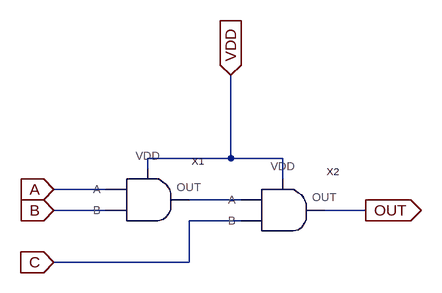
[diagram p0: schematic and3.asc]
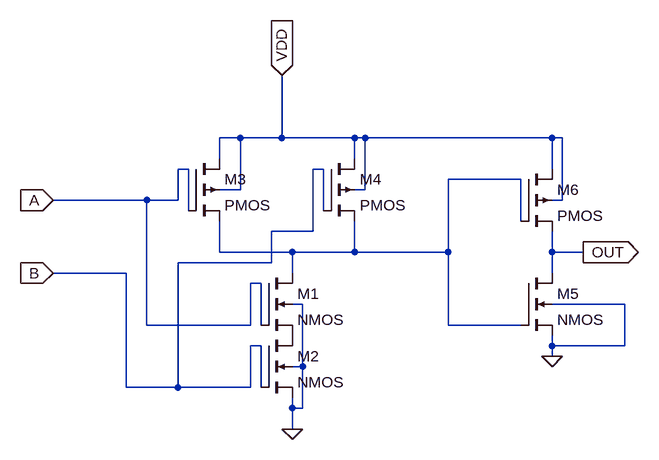
[diagram p1: sub-circuit and.asc]
and3.asc, the LTspice schematic file:
Version 4
SHEET 1 880 680
WIRE 208 16 208 -112
WIRE 208 16 80 16
WIRE 288 16 208 16
WIRE 80 32 80 16
WIRE 288 48 288 16
WIRE 16 64 -64 64
WIRE 224 80 144 80
WIRE 16 96 -64 96
WIRE 416 96 352 96
WIRE 224 112 144 112
WIRE 144 176 144 112
WIRE 144 176 -64 176
FLAG -64 64 A
IOPIN -64 64 In
FLAG -64 96 B
IOPIN -64 96 In
FLAG -64 176 C
IOPIN -64 176 In
FLAG 416 96 OUT
IOPIN 416 96 Out
FLAG 208 -112 VDD
IOPIN 208 -112 In
SYMBOL and 64 80 R0
SYMATTR InstName X1
SYMBOL and 272 96 R0
SYMATTR InstName X2

and.asc, the sub-circuit schematic file:
Version 4
SHEET 1 1116 788
WIRE 112 -32 80 -32
WIRE 176 -32 176 -128
WIRE 176 -32 112 -32
WIRE 288 -32 176 -32
WIRE 304 -32 288 -32
WIRE 592 -32 304 -32
WIRE 608 -32 592 -32
WIRE 80 0 80 -32
WIRE 288 0 288 -32
WIRE 32 16 16 16
WIRE 240 16 224 16
WIRE 592 16 592 -32
WIRE 544 32 432 32
WIRE 112 48 112 -32
WIRE 112 48 80 48
WIRE 304 48 304 -32
WIRE 304 48 288 48
WIRE -32 64 -176 64
WIRE 16 64 16 16
WIRE 16 64 -32 64
WIRE 608 64 608 -32
WIRE 608 64 592 64
WIRE 32 80 32 16
WIRE 240 80 240 16
WIRE 544 96 544 32
WIRE 224 112 224 16
WIRE 224 112 160 112
WIRE 80 144 80 96
WIRE 192 144 80 144
WIRE 288 144 288 96
WIRE 288 144 192 144
WIRE 432 144 432 32
WIRE 432 144 288 144
WIRE 592 144 592 112
WIRE 640 144 592 144
WIRE 160 160 160 112
WIRE 160 160 16 160
WIRE -64 176 -176 176
WIRE 192 176 192 144
WIRE 592 176 592 144
WIRE 144 192 128 192
WIRE 208 224 192 224
WIRE 704 224 592 224
WIRE -32 256 -32 64
WIRE 128 256 128 192
WIRE 128 256 -32 256
WIRE 144 256 144 192
WIRE 432 256 432 144
WIRE 544 256 432 256
WIRE 144 288 128 288
WIRE 592 288 592 272
WIRE 704 288 704 224
WIRE 704 288 592 288
WIRE 592 304 592 288
WIRE 208 320 208 224
WIRE 208 320 192 320
WIRE -64 352 -64 176
WIRE 16 352 16 160
WIRE 16 352 -64 352
WIRE 128 352 128 288
WIRE 128 352 16 352
WIRE 144 352 144 288
WIRE 192 384 192 368
WIRE 208 384 208 320
WIRE 208 384 192 384
WIRE 192 416 192 384
FLAG 192 416 0
FLAG -176 64 A
IOPIN -176 64 In
FLAG -176 176 B
IOPIN -176 176 In
FLAG 176 -128 VDD
IOPIN 176 -128 In
FLAG 592 304 0
FLAG 640 144 OUT
IOPIN 640 144 Out
SYMBOL nmos4 144 176 R0
SYMATTR InstName M1
SYMATTR Value2 l=90n w=200n
SYMBOL nmos4 144 272 R0
SYMATTR InstName M2
SYMATTR Value2 l=90n w=200n
SYMBOL pmos4 32 0 R0
SYMATTR InstName M3
SYMATTR Value2 l=90n w=400n
SYMBOL pmos4 240 0 R0
SYMATTR InstName M4
SYMATTR Value2 l=90n w=400n
SYMBOL nmos4 544 176 R0
SYMATTR Value2 l=90n w=200n
SYMATTR InstName M5
SYMBOL pmos4 544 16 R0
SYMATTR Value2 l=90n w=400n
SYMATTR InstName M6

The netlist it stands for:
* and3.asc
XX1 VDD A B N001 and
XX2 VDD N001 C OUT and

* block symbol definitions
.subckt and VDD A B OUT
M1 N001 A P001 0 NMOS l=90n w=200n
M2 P001 B 0 0 NMOS l=90n w=200n
M3 VDD A N001 VDD PMOS l=90n w=400n
M4 VDD B N001 VDD PMOS l=90n w=400n
M5 OUT N001 0 0 NMOS l=90n w=200n
M6 VDD N001 OUT VDD PMOS l=90n w=400n
.ends and

.model NMOS NMOS
.model PMOS PMOS
.lib standard.mos
.backanno
.end